# Altium project BMS_SLAVE.PrjPcb
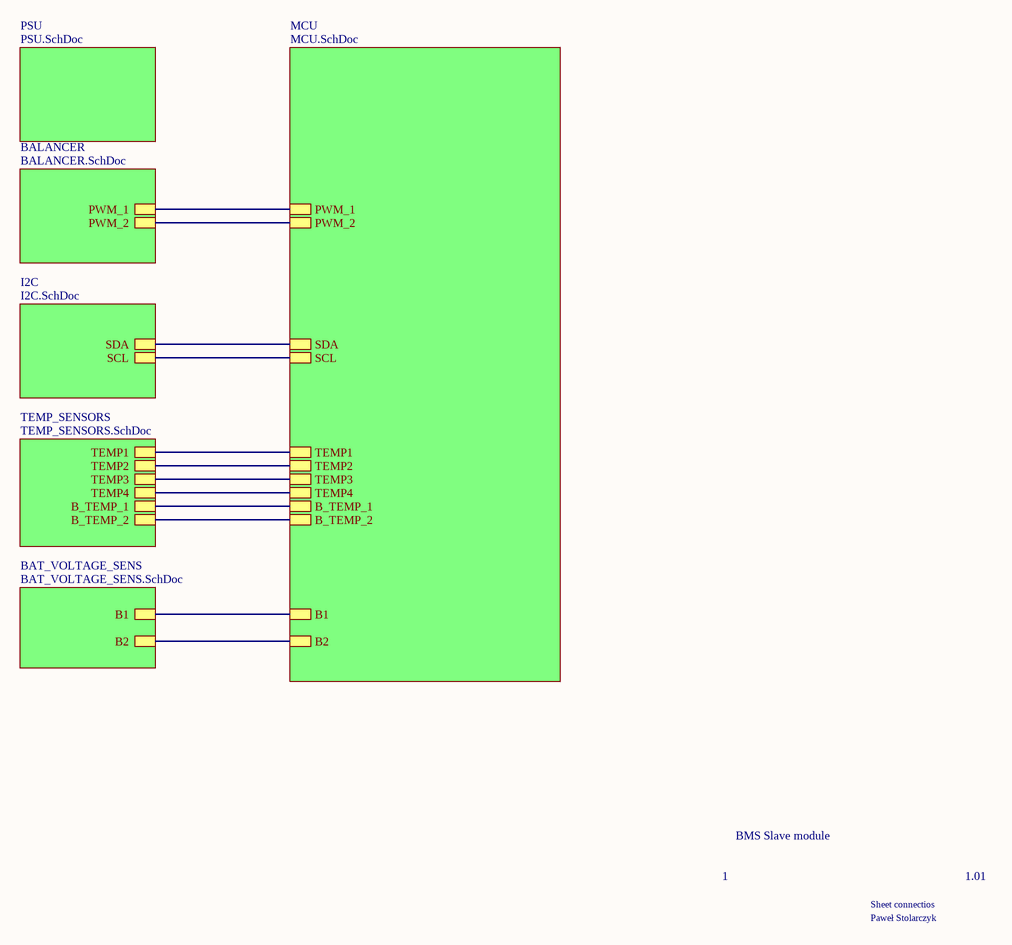
[diagram p0: BMS_SLAVE.SchDoc]
7 sheets, 65 parts. Net scope: hierarchical (ports join the sheet entries above them; power ports are global).
Board file: BMS_SLAVE.PcbDoc
Sheets:
  BMS_SLAVE.SchDoc
    MCU = MCU.SchDoc
    I2C = I2C.SchDoc
    TEMP_SENSORS = TEMP_SENSORS.SchDoc
    BAT_VOLTAGE_SENS = BAT_VOLTAGE_SENS.SchDoc
    PSU = PSU.SchDoc
    BALANCER = BALANCER.SchDoc

## Sheet BMS_SLAVE.SchDoc
size A4; SheetNumber: 1; SheetTotal: 7

### Sub-sheets
BALANCER = BALANCER.SchDoc: PWM_1, PWM_2
BAT_VOLTAGE_SENS = BAT_VOLTAGE_SENS.SchDoc: B1, B2
I2C = I2C.SchDoc: SDA, SCL
MCU = MCU.SchDoc: TEMP1, TEMP2, TEMP3, TEMP4, B1, B2, SDA, SCL, PWM_1, PWM_2, B_TEMP_1, B_TEMP_2
PSU = PSU.SchDoc: no entries
TEMP_SENSORS = TEMP_SENSORS.SchDoc: TEMP1, TEMP2, TEMP3, TEMP4, B_TEMP_1, B_TEMP_2

### Nets
I2C_SCL: sheet MCU/SCL, sheet I2C/SCL
I2C_SDA: sheet MCU/SDA, sheet I2C/SDA
PWM_B1: sheet MCU/PWM_1, sheet BALANCER/PWM_1
PWM_B2: sheet MCU/PWM_2, sheet BALANCER/PWM_2
T1: sheet MCU/TEMP1, sheet TEMP_SENSORS/TEMP1
T2: sheet MCU/TEMP2, sheet TEMP_SENSORS/TEMP2
T3: sheet MCU/TEMP3, sheet TEMP_SENSORS/TEMP3
T4: sheet MCU/TEMP4, sheet TEMP_SENSORS/TEMP4
V_SENS_1: sheet MCU/B1, sheet BAT_VOLTAGE_SENS/B1
V_SENS_2: sheet MCU/B2, sheet BAT_VOLTAGE_SENS/B2
NetIC3_6: sheet MCU/B_TEMP_1, sheet TEMP_SENSORS/B_TEMP_1
NetIC3_7: sheet MCU/B_TEMP_2, sheet TEMP_SENSORS/B_TEMP_2

### Notes on the sheet
- BMS Slave module
- 1
- Sheet connectios
- 1.01
- Paweł Stolarczyk

## Sheet MCU.SchDoc
size A4; SheetNumber: 6; SheetTotal: 7; SPICEModelCacheQIVQBSLI: <root> / <DocumentId>QIVQBSLI</DocumentId> / </root>
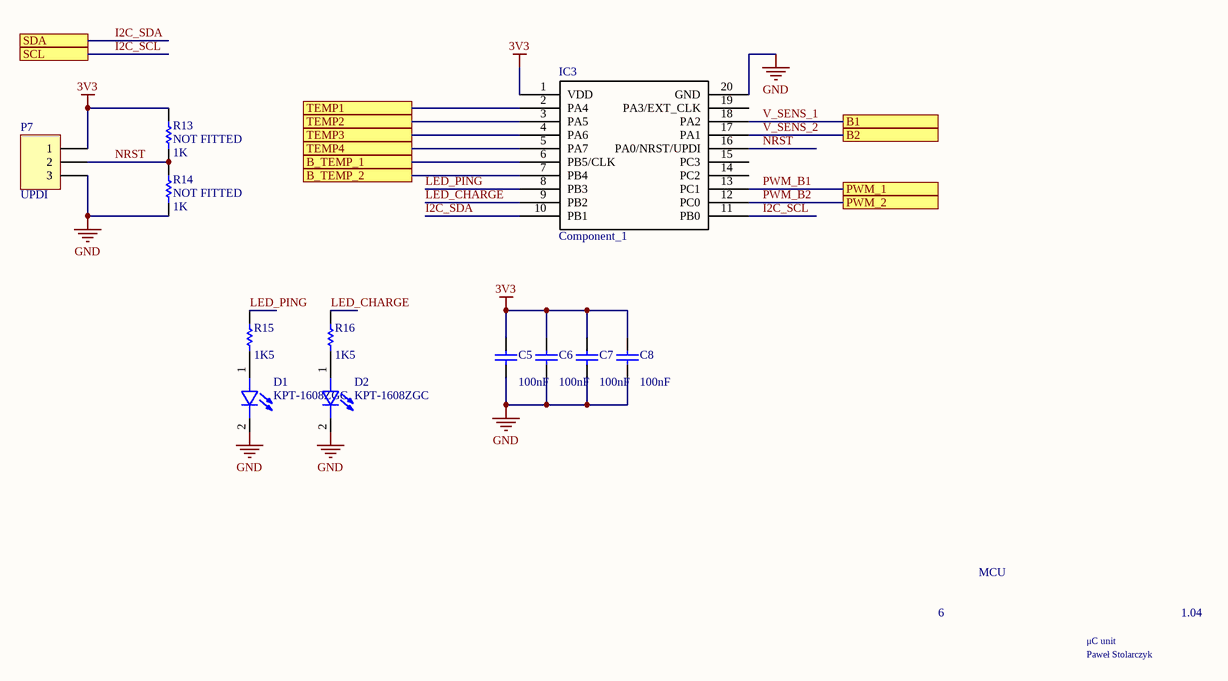
[diagram p1: MCU.SchDoc]

### Parts
C5  value 100nF  [0402]  (hidden comment: Cap)
C6  value 100nF  [0402]  (hidden comment: Cap)
C7  value 100nF  [0402]  (hidden comment: Cap)
C8  value 100nF  [0402]  (hidden comment: Cap)
D1  KPT-1608ZGC  [LED_KPT-1608ZGC]
D2  KPT-1608ZGC  [LED_KPT-1608ZGC]
IC3  Component_1  [SOIC127P1032X265-20N]
P7  UPDI  [HDR1X3]
R13  NOT FITTED  value 1K  [0402]
R14  NOT FITTED  value 1K  [0402]
R15  value 1K5  [0402]  (hidden comment: NOT FITTED)
R16  value 1K5  [0402]  (hidden comment: NOT FITTED)

### Ports
B1 (see BMS_SLAVE[3C], BAT_VOLTAGE_SENS[2C]), B2 (see BMS_SLAVE[3C], BAT_VOLTAGE_SENS[3C]), B_TEMP_1 (see BMS_SLAVE[3C], TEMP_SENSORS[3B]), B_TEMP_2 (see BMS_SLAVE[3C], TEMP_SENSORS[4B]), PWM_1 (see BMS_SLAVE[3B], BALANCER[3D]), PWM_2 (see BMS_SLAVE[3B], BALANCER[1B]), SCL (see BMS_SLAVE[3B], I2C[3C]), SDA (see BMS_SLAVE[3B], I2C[3C]), TEMP1 (see BMS_SLAVE[3C], TEMP_SENSORS[3B]), TEMP2 (see BMS_SLAVE[3C], TEMP_SENSORS[3B]), TEMP3 (see BMS_SLAVE[3C], TEMP_SENSORS[3C]), TEMP4 (see BMS_SLAVE[3C], TEMP_SENSORS[3C])

### Nets
3V3: C5.2 C6.2 C7.2 C8.2 IC3.1(VDD) P7.1 R13.1
GND: C5.1 C6.1 C7.1 C8.1 D1.2(C) D2.2(C) IC3.20(GND) P7.3 R14.2
I2C_SCL: IC3.11(PB0) ; port SCL
I2C_SDA: IC3.10(PB1) ; port SDA
LED_CHARGE: IC3.9(PB2) R16.1
LED_PING: IC3.8(PB3) R15.1
NRST: IC3.16(PA0/NRST/UPDI) P7.2 R13.2 R14.1
PWM_B1: IC3.13(PC1) ; port PWM_1
PWM_B2: IC3.12(PC0) ; port PWM_2
T1: IC3.2(PA4) ; port TEMP1
T2: IC3.3(PA5) ; port TEMP2
T3: IC3.4(PA6) ; port TEMP3
T4: IC3.5(PA7) ; port TEMP4
V_SENS_1: IC3.18(PA2) ; port B1
V_SENS_2: IC3.17(PA1) ; port B2
NetD1_1: D1.1(A) R15.2
NetD2_1: D2.1(A) R16.2
NetIC3_6: IC3.6(PB5/CLK) ; port B_TEMP_1
NetIC3_7: IC3.7(PB4) ; port B_TEMP_2

Not connected (* = marked no-connect by the designer): IC3 14(PC2) 15(PC3) 19(PA3/EXT_CLK)

### Notes on the sheet
- MCU
- 6
- μC unit
- 1.04
- Paweł Stolarczyk

### Library data of the parts
C5-C8 = Cap: Capacitor; Published: 8-Jun-2000; LatestRevisionDate: 17-Jul-2002; LatestRevisionNote: Re-released for DXP Platform.; PackageReference: RAD-0.3; Publisher: Altium Limited; PackageDescription: Radial Cap, Thru-Hole; 2 Leads; 0.3 in Pin Spacing
D1 D2 = KPT-1608ZGC: 1.6x0.8mm Smd Chip Led Lamp; MF: Kingbright; Value: *; SnapEDA_Link: https://www.snapeda.com/parts/KPT-1608ZGC/Kingbright/view-part/?ref=snap; Availability: In Stock; Price: None; Package: 0603 Kingbright; Check_prices: https://www.snapeda.com/parts/KPT-1608ZGC/Kingbright/view-part/?ref=eda; MP: KPT-1608ZGC
P7 = Header 3: Header, 3-Pin; LatestRevisionDate: 17-Jul-2002; LatestRevisionNote: Re-released for DXP Platform.; Publisher: Altium Limited
R13-R16 = Res1: Resistor; Published: 8-Jun-2000; LatestRevisionDate: 17-Jul-2002; LatestRevisionNote: Re-released for DXP Platform.; PackageReference: AXIAL-0.3; Publisher: Altium Limited; PackageDescription: Axial Device, Thru-Hole; 2 Leads; 0.3 in Pin Spacing

## Sheet I2C.SchDoc
size A4; SheetNumber: 2; SheetTotal: 7
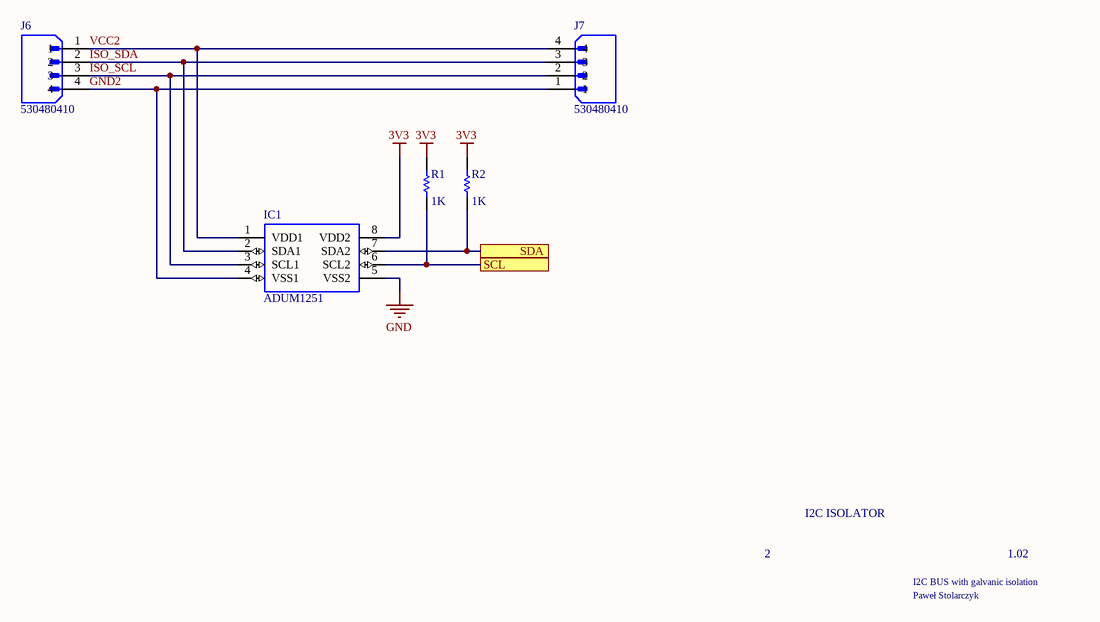
[diagram p2: I2C.SchDoc]

### Parts
IC1  ADUM1251  [SOIC127P600X175-8N]
J6  530480410  [MOLEX_530480410]
J7  530480410  [MOLEX_530480410]
R1  value 1K  [0402]  (hidden comment: Res1)
R2  value 1K  [0402]  (hidden comment: Res1)

### Ports
SCL (see BMS_SLAVE[2B], MCU[1B]), SDA (see BMS_SLAVE[2B], MCU[1B])

### Nets
3V3: IC1.8(VDD2) R1.2 R2.2
GND: IC1.5(VSS2)
GND2: IC1.4(VSS1) J6.4 J7.1
I2C_SCL: IC1.6(SCL2) R1.1 ; port SCL
I2C_SDA: IC1.7(SDA2) R2.1 ; port SDA
ISO_SCL: IC1.3(SCL1) J6.3 J7.2
ISO_SDA: IC1.2(SDA1) J6.2 J7.3
VCC2: IC1.1(VDD1) J6.1 J7.4

### Notes on the sheet
- I2C ISOLATOR
- 2
- I2C BUS with galvanic isolation
- 1.02
- Paweł Stolarczyk

### Library data of the parts
IC1 = ADUM1251: IÂ²C Digital Isolator 2500Vrms 2 Channel 1Mbps 25kV/Âµs CMTI 8-SOIC (0.154, 3.90mm Width); MF: Analog Devices; Package: SOIC-8 Analog Devices; MP: ADUM1251; Value: *; Price: None; SnapEDA_Link: https://www.snapeda.com/parts/ADUM1251/Analog%20Devices%20Inc./view-part/3223540/?ref=snap; Availability: Unavailable
R1 R2 = Res1: Resistor; Published: 8-Jun-2000; LatestRevisionDate: 17-Jul-2002; LatestRevisionNote: Re-released for DXP Platform.; PackageReference: AXIAL-0.3; Publisher: Altium Limited; PackageDescription: Axial Device, Thru-Hole; 2 Leads; 0.3 in Pin Spacing
J6 J7 = 530480410: Availability: Unavailable; Price: None; Package: None; Value: *; MP: 530480410

## Sheet TEMP_SENSORS.SchDoc
size A4; SheetNumber: 3; SheetTotal: 7
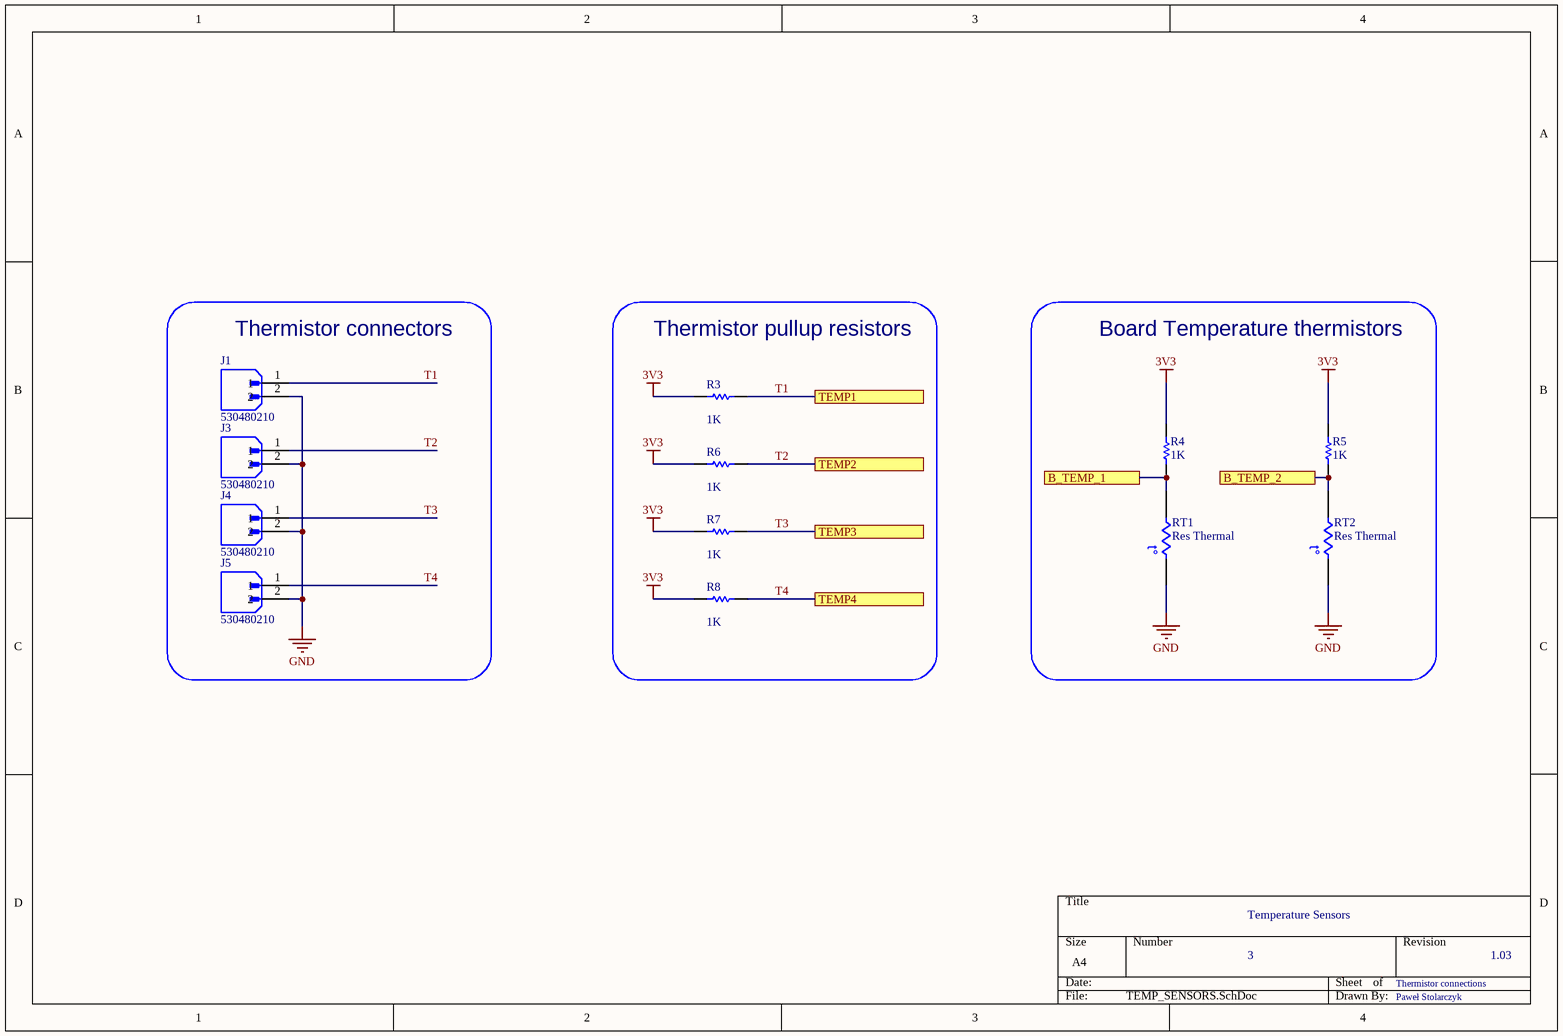
[diagram p3: TEMP_SENSORS.SchDoc]

### Parts
J1  530480210  [MOLEX_530480210]
J3  530480210  [MOLEX_530480210]
J4  530480210  [MOLEX_530480210]
J5  530480210  [MOLEX_530480210]
R3  value 1K  [0402]  (hidden comment: Res1)
R4  value 1K  [0402]  (hidden comment: Res1)
R5  value 1K  [0402]  (hidden comment: Res1)
R6  value 1K  [0402]  (hidden comment: Res1)
R7  value 1K  [0402]  (hidden comment: Res1)
R8  value 1K  [0402]  (hidden comment: Res1)
RT1  Res Thermal  [0402]
RT2  Res Thermal  [0402]

### Blocks framed on the sheet
Thermistor connectors: J1 J3-J5
Thermistor pullup resistors: R3 R6-R8
Board Temperature thermistors: R4 R5 RT1 RT2

### Ports
B_TEMP_1 (see BMS_SLAVE[2C], MCU[2B]), B_TEMP_2 (see BMS_SLAVE[2C], MCU[2C]), TEMP1 (see BMS_SLAVE[2C], MCU[2B]), TEMP2 (see BMS_SLAVE[2C], MCU[2B]), TEMP3 (see BMS_SLAVE[2C], MCU[2B]), TEMP4 (see BMS_SLAVE[2C], MCU[2B])

### Nets
3V3: R3.2 R4.2 R5.2 R6.2 R7.2 R8.2
GND: J1.2 J3.2 J4.2 J5.2 RT1.1 RT2.1
T1: J1.1 R3.1 ; port TEMP1
T2: J3.1 R6.1 ; port TEMP2
T3: J4.1 R7.1 ; port TEMP3
T4: J5.1 R8.1 ; port TEMP4
NetIC3_6: R4.1 RT1.2 ; port B_TEMP_1
NetIC3_7: R5.1 RT2.2 ; port B_TEMP_2

### Notes on the sheet
- Temperature Sensors
- 3
- Thermistor connections
- 1.03
- Paweł Stolarczyk
- (in symbol Res Thermal) t°

### Library data of the parts
J1 J3-J5 = 530480210: Conn Shrouded Header (4 Sides) HDR 2 POS 1.25mm Solder RA Side Entry Thru-Hole PicoBladeâ„¢ Tray; MF: Molex; SnapEDA_Link: https://www.snapeda.com/parts/530480210/Molex/view-part/?ref=snap; Value: *; Purchase-URL: https://pricing.snapeda.com/search/part/530480210/?ref=eda; Check_prices: https://www.snapeda.com/parts/530480210/Molex/view-part/?ref=eda; Availability: In Stock; Price: None; MP: 530480210; Package: None
R3-R8 = Res1: Resistor; Published: 8-Jun-2000; LatestRevisionDate: 17-Jul-2002; LatestRevisionNote: Re-released for DXP Platform.; PackageReference: AXIAL-0.3; Publisher: Altium Limited; PackageDescription: Axial Device, Thru-Hole; 2 Leads; 0.3 in Pin Spacing
RT1 RT2 = Res Thermal: Thermistor; Published: 24-Mar-1999; LatestRevisionDate: 29-May-2009; LatestRevisionNote: IPC-7351 Footprint Added.; PackageVersion: Mar-2003; PackageReference: 6-0805; Publisher: Altium Limited; PackageDescription: Chip Resistor 0805 Case Size; Code_IPC: RESC2012

## Sheet BAT_VOLTAGE_SENS.SchDoc
size A4; SheetNumber: 4; SheetTotal: 7
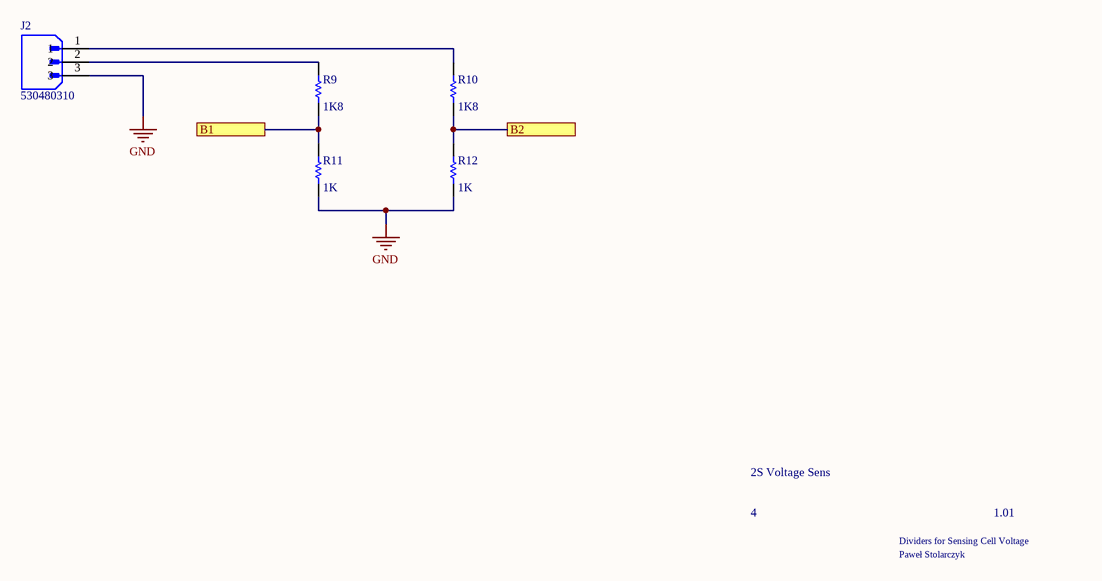
[diagram p4: BAT_VOLTAGE_SENS.SchDoc]

### Parts
J2  530480310  [MOLEX_530480310]
R9  value 1K8  [0402]  (hidden comment: Res1)
R10  value 1K8  [0402]  (hidden comment: Res1)
R11  value 1K  [0402]  (hidden comment: Res1)
R12  value 1K  [0402]  (hidden comment: Res1)

### Ports
B1 (see BMS_SLAVE[2C], MCU[3B]), B2 (see BMS_SLAVE[2C], MCU[3B])

### Nets
GND: J2.3 R11.1 R12.1
V_SENS_1: R9.1 R11.2 ; port B1
V_SENS_2: R10.1 R12.2 ; port B2
NetJ2_1: J2.1 R10.2
NetJ2_2: J2.2 R9.2

### Notes on the sheet
- 2S Voltage Sens
- 4
- Dividers for Sensing Cell Voltage
- 1.01
- Paweł Stolarczyk

### Library data of the parts
R9-R12 = Res1: Resistor; Published: 8-Jun-2000; LatestRevisionDate: 17-Jul-2002; LatestRevisionNote: Re-released for DXP Platform.; PackageReference: AXIAL-0.3; Publisher: Altium Limited; PackageDescription: Axial Device, Thru-Hole; 2 Leads; 0.3 in Pin Spacing
J2 = 530480310: Package: None; MP: 530480310; Value: *; Availability: Unavailable; Price: None

## Sheet PSU.SchDoc
size A4; SheetNumber: 5; SheetTotal: 7
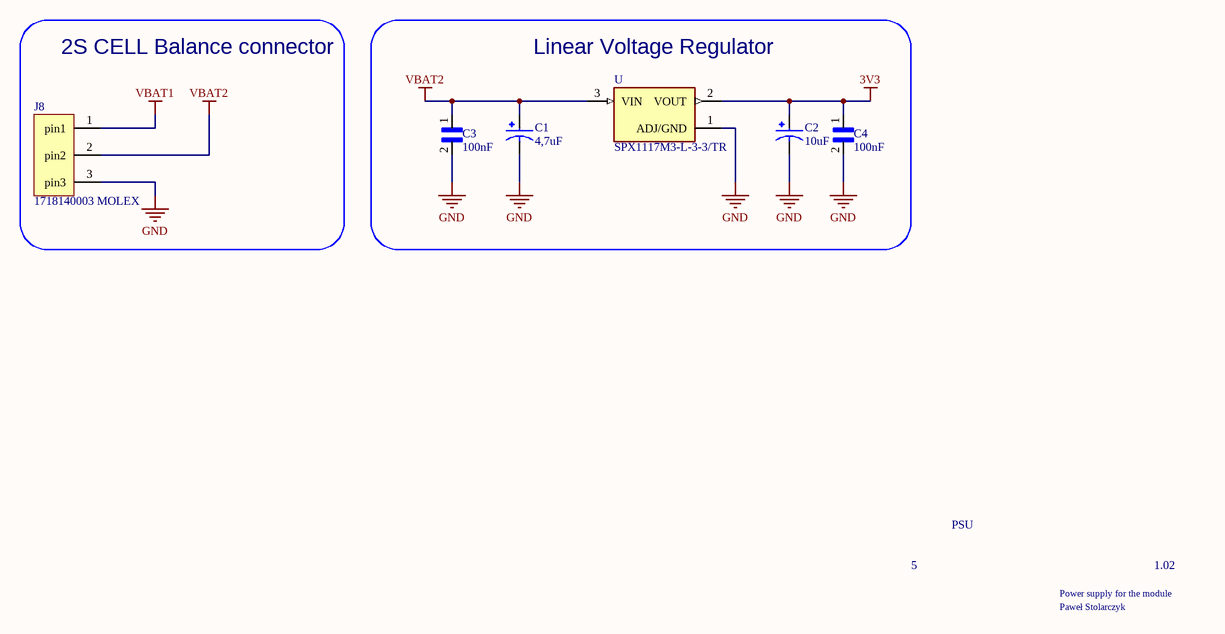
[diagram p5: PSU.SchDoc]

### Parts
C1  4,7uF  [CAP_EEE1CA100SR]
C2  10uF  [CAP_EEE1CA100SR]
C3  100nF  [CAPC1608X90N]
C4  100nF  [CAPC1608X90N]
J8  1718140003 MOLEX  [3pinangled]
U  SPX1117M3-L-3-3/TR  [SOT230P700X180-3N]

### Blocks framed on the sheet
2S CELL Balance connector: J8
Linear Voltage Regulator: C1-C4 U

### Nets
3V3: C2.1 C4.1 U.2(VOUT)
GND: C1.2 C2.2 C3.2 C4.2 J8.3(pin3) U.1(ADJ/GND)
VBAT1: J8.1(pin1)
VBAT2: C1.1 C3.1 J8.2(pin2) U.3(VIN)

### Notes on the sheet
- PSU
- 5
- Power supply for the module
- 1.02
- Paweł Stolarczyk

### Library data of the parts
C1 C2 = EEE1CA100SR: 10ÂµF 16V Aluminum Electrolytic Capacitors Radial, Can - SMD 2000 Hrs @ 85Â°C; MF: Panasonic; Digi-Key_Part_Number: PCE3878CT-ND; Check_prices: https://www.snapeda.com/parts/EEE1CA100SR/Panasonic/view-part/?ref=eda; Value: *; MP: EEE1CA100SR; Package: RADIAL-2 Panasonic; SnapEDA_Link: https://www.snapeda.com/parts/EEE1CA100SR/Panasonic/view-part/?ref=snap
C3 C4 = C0603C104J4RAC: 0.1ÂµF Â±5% 16V Ceramic Capacitor X7R 0603 (1608 Metric); MF: KEMET; MP: C0603C104J4RAC; SnapEDA_Link: https://www.snapeda.com/parts/C0603C104J4RAC/KEMET/view-part/1763758/?ref=snap; Availability: Warning; Package: 0603 KEMET; Check_prices: https://www.snapeda.com/parts/C0603C104J4RAC/KEMET/view-part/1763758/?ref=eda; Value: *; Price: None
J8 = 3pinangled
U = SPX1117M3-L-3-3/TR: Linear Voltage Regulator IC Positive Fixed 1 Output 800mA SOT-223; MF: MaxLinear, Inc.; Value: *; SnapEDA_Link: https://www.snapeda.com/parts/SPX1117M3-L-3-3/TR/MaxLinear%2C%20Inc./view-part/376705/?ref=snap; Package: SOT-223 Exar; MP: SPX1117M3-L-3-3/TR; Price: None; Availability: Unavailable

## Sheet BALANCER.SchDoc
size A4; SheetNumber: 7; SheetTotal: 7
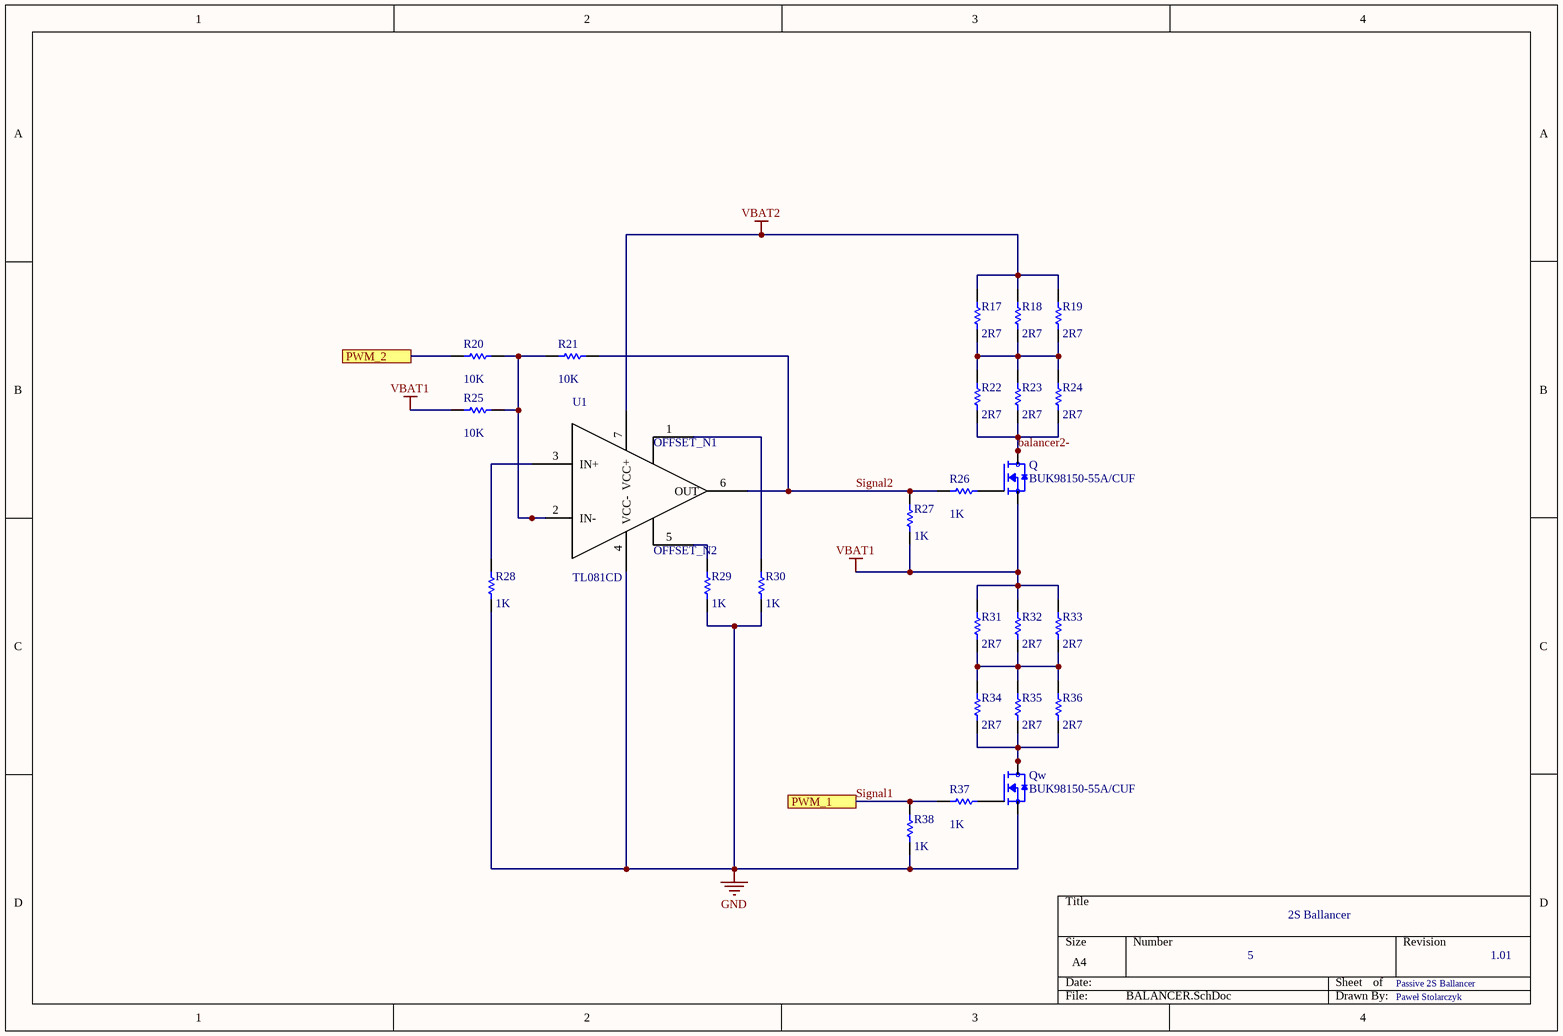
[diagram p6: BALANCER.SchDoc]

### Parts
Q  BUK98150-55A/CUF  [SOT230P700X180-4N]
Qw  BUK98150-55A/CUF  [SOT230P700X180-4N]
R17  value 2R7  [C2512]  (hidden comment: Res1)
R18  value 2R7  [C2512]  (hidden comment: Res1)
R19  value 2R7  [C2512]  (hidden comment: Res1)
R20  value 10K  [0402]  (hidden comment: Res1)
R21  value 10K  [0402]  (hidden comment: Res1)
R22  value 2R7  [C2512]  (hidden comment: Res1)
R23  value 2R7  [C2512]  (hidden comment: Res1)
R24  value 2R7  [C2512]  (hidden comment: Res1)
R25  value 10K  [0402]  (hidden comment: Res1)
R26  value 1K  [0402]  (hidden comment: Res1)
R27  value 1K  [0402]  (hidden comment: Res1)
R28  value 1K  [0402]  (hidden comment: Res1)
R29  value 1K  [0402]  (hidden comment: Res1)
R30  value 1K  [0402]  (hidden comment: Res1)
R31  value 2R7  [C2512]  (hidden comment: Res1)
R32  value 2R7  [C2512]  (hidden comment: Res1)
R33  value 2R7  [C2512]  (hidden comment: Res1)
R34  value 2R7  [C2512]  (hidden comment: Res1)
R35  value 2R7  [C2512]  (hidden comment: Res1)
R36  value 2R7  [C2512]  (hidden comment: Res1)
R37  value 1K  [0402]  (hidden comment: Res1)
R38  value 1K  [0402]  (hidden comment: Res1)
U1  TL081CD  [SOIC127P599X175-8N]

### Ports
PWM_1 (see BMS_SLAVE[2B], MCU[3C]), PWM_2 (see BMS_SLAVE[2B], MCU[3C])

### Nets
GND: Qw.3(S) R28.1 R29.1 R30.1 R38.1 U1.4(VCC-)
VBAT1: Q.3(S) R25.1 R27.1 R31.2 R32.2 R33.2
VBAT2: R17.2 R18.2 R19.2 U1.7(VCC+)
balancer2-: Q.2(D) Q.4(D) R22.1 R23.1 R24.1
PWM_B2: R20.1 ; port PWM_2
Signal1: R37.1 R38.2 ; port PWM_1  [project net PWM_B1]
Signal2: R21.2 R26.1 R27.2 U1.6(OUT)
NetQ_1: Q.1(G) R26.2
NetQw_1: Qw.1(G) R37.2
NetQw_2: Qw.2(D) Qw.4(D) R34.1 R35.1 R36.1
NetR17_1: R17.1 R18.1 R19.1 R22.2 R23.2 R24.2
NetR20_2: R20.2 R21.1 R25.2 U1.2(IN-)
NetR28_2: R28.2 U1.3(IN+)
NetR29_2: R29.2 U1.5(OFFSET_N2)
NetR30_2: R30.2 U1.1(OFFSET_N1)
NetR31_1: R31.1 R32.1 R33.1 R34.2 R35.2 R36.2

### Notes on the sheet
- 2S Ballancer
- 5
- Passive 2S Ballancer
- 1.01
- Paweł Stolarczyk

### Library data of the parts
Q Qw = BUK98150-55A/CUF: N-Channel 55V 5.5A _Tc_ 8W _Tc_ Surface Mount SOT-223; MF: Nexperia USA; Availability: Unavailable; SnapEDA_Link: https://www.snapeda.com/parts/BUK98150-55A/CUF/Nexperia%20USA%20Inc./view-part/2783744/?ref=snap; DigiKey-Purchase-URL: https://snapeda.com/shop?store=DigiKey&id=2783744; MP: BUK98150-55A/CUF; Value: *; Price: None; Package: TO-261-4 Nexperia USA
R17-R38 = Res1: Resistor; Published: 8-Jun-2000; LatestRevisionDate: 17-Jul-2002; LatestRevisionNote: Re-released for DXP Platform.; PackageReference: AXIAL-0.3; Publisher: Altium Limited; PackageDescription: Axial Device, Thru-Hole; 2 Leads; 0.3 in Pin Spacing
U1 = TL081CD: High Slew Rate JFET-Input Operational Amplifier 8-SOIC 0 to 70; MF: Texas Instruments; Package: SOIC-8 Texas Instruments; SnapEDA_Link: https://www.snapeda.com/parts/TL081CD/Texas%20Instruments/view-part/4793911/?ref=snap; MP: TL081CD; Availability: Good; Price: None; Value: *; Purchase-URL: https://pricing.snapeda.com/search/part/TL081CD/?ref=eda

## Nets that join several sheets
3V3: MCU (7 pins), I2C (IC1.8 R1.2 R2.2), TEMP_SENSORS (6 pins), PSU (C2.1 C4.1 U.2)
GND: MCU (9 pins), I2C (IC1.5), TEMP_SENSORS (6 pins), BAT_VOLTAGE_SENS (J2.3 R11.1 R12.1), PSU (6 pins), BALANCER (6 pins)
VBAT1: PSU (J8.1), BALANCER (6 pins)
VBAT2: PSU (C1.1 C3.1 J8.2 U.3), BALANCER (R17.2 R18.2 R19.2 U1.7)
I2C_SCL: MCU (IC3.11), I2C (IC1.6 R1.1)
I2C_SDA: MCU (IC3.10), I2C (IC1.7 R2.1)
NetIC3_6: MCU (IC3.6), TEMP_SENSORS (R4.1 RT1.2)
NetIC3_7: MCU (IC3.7), TEMP_SENSORS (R5.1 RT2.2)
PWM_B1: MCU (IC3.13), BALANCER (R37.1 R38.2)
PWM_B2: MCU (IC3.12), BALANCER (R20.1)
T1: MCU (IC3.2), TEMP_SENSORS (J1.1 R3.1)
T2: MCU (IC3.3), TEMP_SENSORS (J3.1 R6.1)
T3: MCU (IC3.4), TEMP_SENSORS (J4.1 R7.1)
T4: MCU (IC3.5), TEMP_SENSORS (J5.1 R8.1)
V_SENS_1: MCU (IC3.18), BAT_VOLTAGE_SENS (R9.1 R11.2)
V_SENS_2: MCU (IC3.17), BAT_VOLTAGE_SENS (R10.1 R12.2)